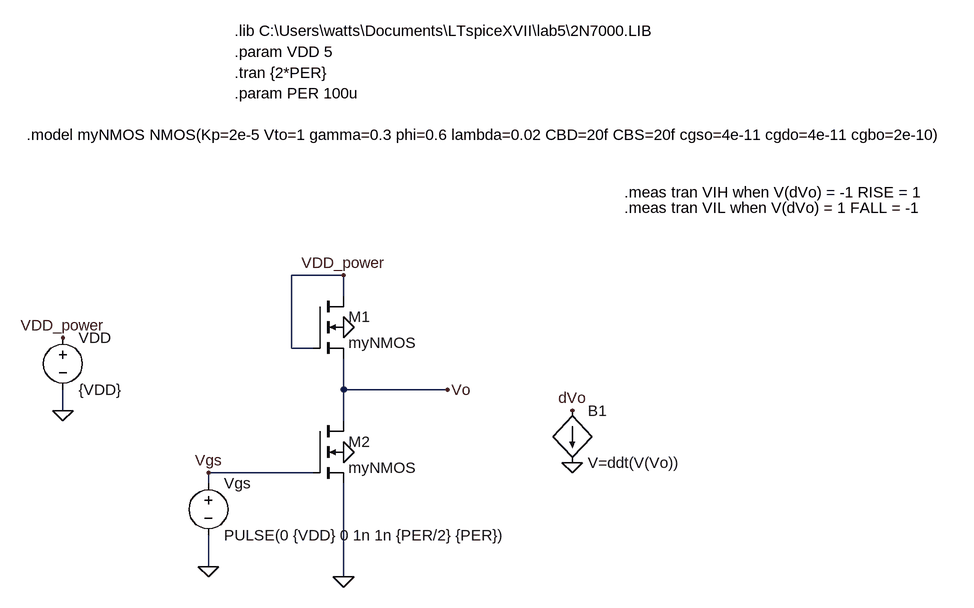
[diagram p0: schematic NMOS_saturated_load_logic_time.asc]
NMOS_saturated_load_logic_time.asc, the LTspice schematic file:
Version 4
SHEET 1 1328 680
WIRE 272 -128 192 -128
WIRE 272 -96 272 -128
WIRE 192 -16 192 -128
WIRE 224 -16 192 -16
WIRE 272 48 272 0
WIRE 432 48 272 48
WIRE -160 80 -160 48
WIRE 272 96 272 48
WIRE 224 176 64 176
WIRE 64 192 64 176
WIRE 64 320 64 272
WIRE 272 336 272 192
FLAG 64 320 0
FLAG -160 80 0
FLAG -160 -32 VDD_power
FLAG 272 -128 VDD_power
FLAG 432 48 Vo
FLAG 272 336 0
FLAG 624 160 0
FLAG 624 80 dVo
FLAG 64 176 Vgs
FLAG 272 -48 0
FLAG 272 144 0
SYMBOL voltage 64 176 R0
WINDOW 123 0 0 Left 0
WINDOW 39 0 0 Left 0
SYMATTR InstName Vgs
SYMATTR Value PULSE(0 {VDD} 0 1n 1n {PER/2} {PER})
SYMBOL voltage -160 -48 R0
SYMATTR InstName VDD
SYMATTR Value {VDD}
SYMBOL bi 624 80 R0
SYMATTR InstName B1
SYMATTR Value V=ddt(V(Vo))
SYMBOL nmos4 224 -96 R0
SYMATTR InstName M1
SYMATTR Value myNMOS
SYMBOL nmos4 224 96 R0
SYMATTR InstName M2
SYMATTR Value myNMOS
TEXT 104 -504 Left 2 !.lib C:\\Users\\watts\\Documents\\LTspiceXVII\\lab5\\2N7000.LIB
TEXT 104 -472 Left 2 !.param VDD 5
TEXT 104 -440 Left 2 !.tran {2*PER}
TEXT 104 -408 Left 2 !.param PER 100u
TEXT -216 -344 Left 2 !.model myNMOS NMOS(Kp=2e-5 Vto=1 gamma=0.3 phi=0.6 lambda=0.02 CBD=20f CBS=20f cgso=4e-11 cgdo=4e-11 cgbo=2e-10)
TEXT 704 -256 Left 2 !.meas tran VIH when V(dVo) = -1 RISE = 1
TEXT 704 -232 Left 2 !.meas tran VIL when V(dVo) = 1 FALL = -1

The netlist it stands for:
* NMOS_saturated_load_logic_time.asc
Vgs Vgs 0 PULSE(0 {VDD} 0 1n 1n {PER/2} {PER})
VDD VDD_power 0 {VDD}
B1 dVo 0 V=ddt(V(Vo))
M1 VDD_power VDD_power Vo 0 myNMOS
M2 Vo Vgs 0 0 myNMOS
.model NMOS NMOS
.model PMOS PMOS
.lib standard.mos
.lib C:\Users\watts\Documents\LTspiceXVII\lab5\2N7000.LIB
.param VDD 5
.tran {2*PER}
.param PER 100u
.model myNMOS NMOS(Kp=2e-5 Vto=1 gamma=0.3 phi=0.6 lambda=0.02 CBD=20f CBS=20f cgso=4e-11 cgdo=4e-11 cgbo=2e-10)
.meas tran VIH when V(dVo) = -1 RISE = 1
.meas tran VIL when V(dVo) = 1 FALL = -1
.backanno
.end